# EAGLE schematic Konnektduino.core.Rev.1.0 (EAGLE 8.6.0)
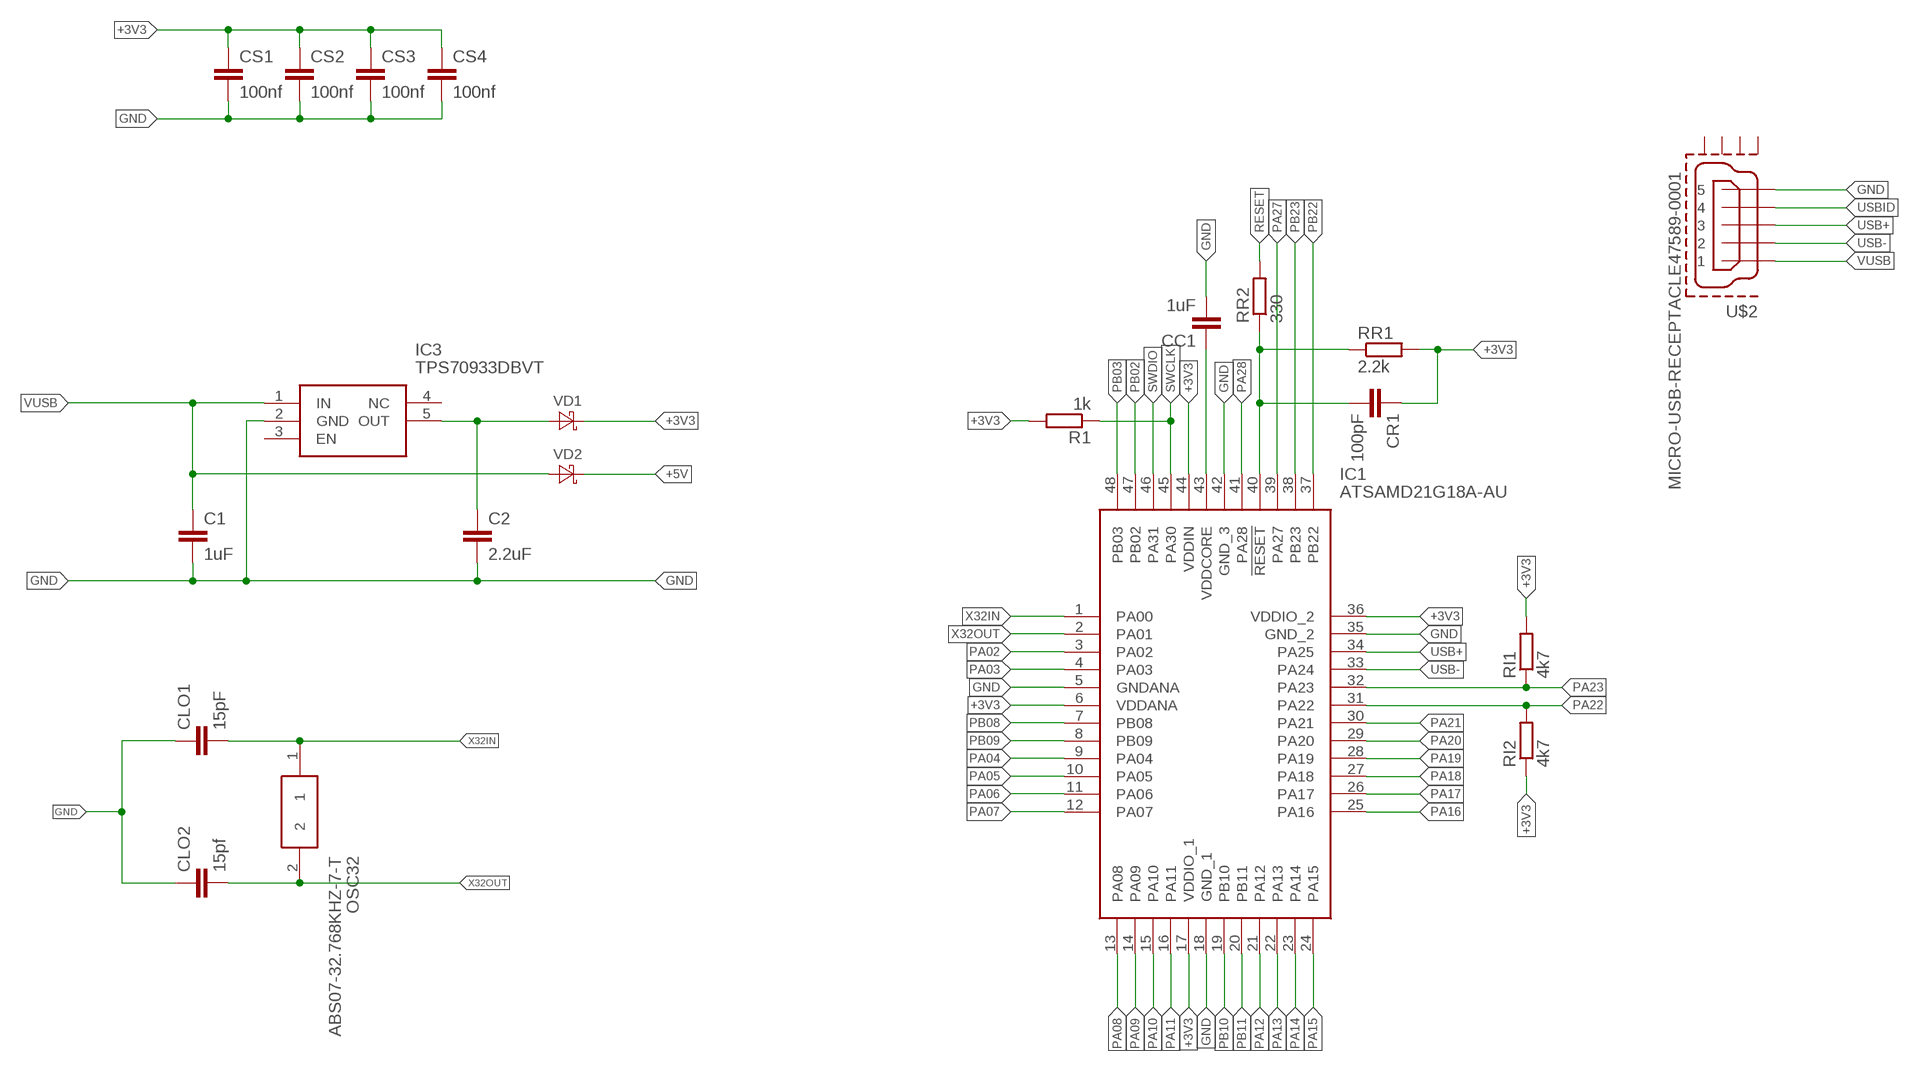
[diagram p0: schematic, sheet 1]

## Parts
C1  1uF  C-EUC0603  [C0603]
C2  2.2uF  C-EUC0603  [C0603]
CC1  1uF  C-EUC0603  [C0603]
CLO1  15pF  C-EUC0603  [C0603]
CLO2  15pf  C-EUC0603  [C0603]
CR1  100pF  C-EUC0603  [C0603]
CS1  100nf  C-EUC0603  [C0603]
CS2  100nf  C-EUC0603  [C0603]
CS3  100nf  C-EUC0603  [C0603]
CS4  100nf  C-EUC0603  [C0603]
IC1  ATSAMD21G18A-AU  [QFP50P900X900X120-48N]
IC3  TPS70933DBVT  [SOT95P280X145-5N]
OSC32  ABS07-32.768KHZ-7-T  [ABS-07]
R1  1k  R-EU_R0603  [R0603]
RI1  4k7  R-EU_R0603  [R0603]
RI2  4k7  R-EU_R0603  [R0603]
RR1  2.2k  R-EU_R0603  [R0603]
RR2  330  R-EU_R0603  [R0603]
U$2  MICRO-USB-RECEPTACLE47589-0001  [47589-0001]
VD1  DIODE-SCHOTTKY-0603  [D0603]
VD2  DIODE-SCHOTTKY-0603  [D0603]

## Nets
+3V3: CR1.1 CS1.1 CS2.1 CS3.1 CS4.1 IC1.6(VDDANA) IC1.17(VDDIO_1) IC1.36(VDDIO_2) IC1.44(VDDIN) R1.2 RI1.2 RI2.1 RR1.2 VD1.C
+5V: VD2.C
GND: C1.2 C2.2 CC1.2 CLO1.1 CLO2.1 CS1.2 CS2.2 CS3.2 CS4.2 IC1.5(GNDANA) IC1.18(GND_1) IC1.35(GND_2) IC1.42(GND_3) IC3.2(GND) U$2.5
N$23: C2.1 IC3.5(OUT) VD1.A
NRST: CR1.2 IC1.40(!RESET) RR1.1 RR2.1
PA02: IC1.3(PA02)
PA03: IC1.4(PA03)
PA04: IC1.9(PA04)
PA05: IC1.10(PA05)
PA06: IC1.11(PA06)
PA07: IC1.12(PA07)
PA08: IC1.13(PA08)
PA09: IC1.14(PA09)
PA10: IC1.15(PA10)
PA11: IC1.16(PA11)
PA12: IC1.21(PA12)
PA13: IC1.22(PA13)
PA14: IC1.23(PA14)
PA15: IC1.24(PA15)
PA16: IC1.25(PA16)
PA17: IC1.26(PA17)
PA18: IC1.27(PA18)
PA19: IC1.28(PA19)
PA20: IC1.29(PA20)
PA21: IC1.30(PA21)
PA22: IC1.31(PA22) RI2.2
PA23: IC1.32(PA23) RI1.1
PA27: IC1.39(PA27)
PA28: IC1.41(PA28)
PB02: IC1.47(PB02)
PB03: IC1.48(PB03)
PB08: IC1.7(PB08)
PB09: IC1.8(PB09)
PB10: IC1.19(PB10)
PB11: IC1.20(PB11)
PB22: IC1.37(PB22)
PB23: IC1.38(PB23)
RESET: RR2.2
SWCLK: IC1.45(PA30) R1.1
SWDIO: IC1.46(PA31)
USB+: IC1.34(PA25) U$2.3
USB-: IC1.33(PA24) U$2.2
USBID: U$2.4
VDDCORE: CC1.1 IC1.43(VDDCORE)
VUSB: C1.1 IC3.1(IN) U$2.1 VD2.A
X32IN: CLO1.2 IC1.1(PA00) OSC32.1
X32OUT: CLO2.2 IC1.2(PA01) OSC32.2
Unconnected: IC3.3(EN) IC3.4(NC) U$2.CASING1(GND1) U$2.CASING2(GND2) U$2.CASING3(GND3) U$2.CASING4(GND4)

## Library data of the parts
C1 C2 CC1 CLO1 CLO2 CR1 CS1-CS4 = rcl:C-EU: CAPACITOR, European symbol; SPICEPREFIX: C
IC1 = ATSAMD21G18A-AU:ATSAMD21G18A-AU: ATMEL - ATSAMD21G18A-AU - MCU, 32BIT, CORTEX-M0+, 48MHZ, TQFP-48 Source: Datasheet <http://www.farnell.com/datasheets/1807566.pdf>; ARROW_PART_NUMBER: ATSAMD21G18A-AU; ARROW_PRICE-STOCK: https://www.arrow.com/en/products/atsamd21g18a-au/microchip-technology; DESCRIPTION: ATMEL - ATSAMD21G18A-AU - MCU, 32BIT, CORTEX-M0+, 48MHZ, TQFP-48; HEIGHT: 1.2mm; MANUFACTURER_NAME: Microchip; MANUFACTURER_PART_NUMBER: ATSAMD21G18A-AU; RS_PART_NUMBER: 1773799P; RS_PRICE-STOCK: http://uk.rs-online.com/web/p/products/1773799P
IC3 = TPS70933DBVT:TPS70933DBVT: 150mA 30V Ultra-Low-Iq Wide-Input Low-Dropout (LDO) Regulator With Reverse Current Protection Source: Datasheet <http://www.ti.com/lit/gpn/tps709>; ARROW_PART_NUMBER: TPS70933DBVT; ARROW_PRICE-STOCK: https://www.arrow.com/en/products/tps70933dbvt/texas-instruments; DESCRIPTION: 150mA 30V Ultra-Low-Iq Wide-Input Low-Dropout (LDO) Regulator With Reverse Current Protection; HEIGHT: 1.45mm; MANUFACTURER_NAME: Texas Instruments; MANUFACTURER_PART_NUMBER: TPS70933DBVT; RS_PART_NUMBER: 8257033P; RS_PRICE-STOCK: http://uk.rs-online.com/web/p/products/8257033P
OSC32 = ABS07-32.768KHZ-7-T:ABS07-32.768KHZ-7-T: ABRACON - ABS07-32.768KHZ-7-T - CRYSTAL, 32.768KHZ, 7PF, SMD Source: Datasheet <https://componentsearchengine.com/Datasheets/2/ABS07-32.768KHZ-7-T.pdf>; ARROW_PART_NUMBER: ABS07-32.768KHZ-7-T; ARROW_PRICE/STOCK: https://www.arrow.com/en/products/abs07-32.768khz-7-t/abracon; DESCRIPTION: ABRACON - ABS07-32.768KHZ-7-T - CRYSTAL, 32.768KHZ, 7PF, SMD; HEIGHT: mm; MANUFACTURER_NAME: ABRACON; MANUFACTURER_PART_NUMBER: ABS07-32.768KHZ-7-T; RS_PART_NUMBER: 1712773P; RS_PRICE/STOCK: http://uk.rs-online.com/web/p/products/1712773P
R1 RI1 RI2 RR1 RR2 = resistor:R-EU_: RESISTOR, European symbol
U$2 = con-molex-usb:MICRO-USB-RECEPTACLE: MICRO USB RECEPTACLES Micro-USB Receptacles, SMT, Lead-Free from MOLEX <http://www.molex.com/>. (C) 2014 Tomasz Boleslaw CEDRO, cederom@tlen.pl, http://www.tomek.cedro.info. Version 0.1 (2014-01-17): Initial release. Version 0.2 (2014-02-06): Updated 47589-0001 footprint pins/pads/milling. Following devices are included: 1. 47589-0001 Micro-USB AB Receptacle, Bottom Mount, SMT, Lead-Free <http://www.molex.com/molex/products/datasheet.jsp?part=active/0475890001_IO_CONNECTORS.xml> (Technical Drawing <http://www.molex.com/pdm_docs/sd/475890001_sd.pdf>).
VD1 VD2 = diode:DIODE-SCHOTTKY-: SCHOTTKY DIODE